# Altium project AI_Thinker.PrjPCB
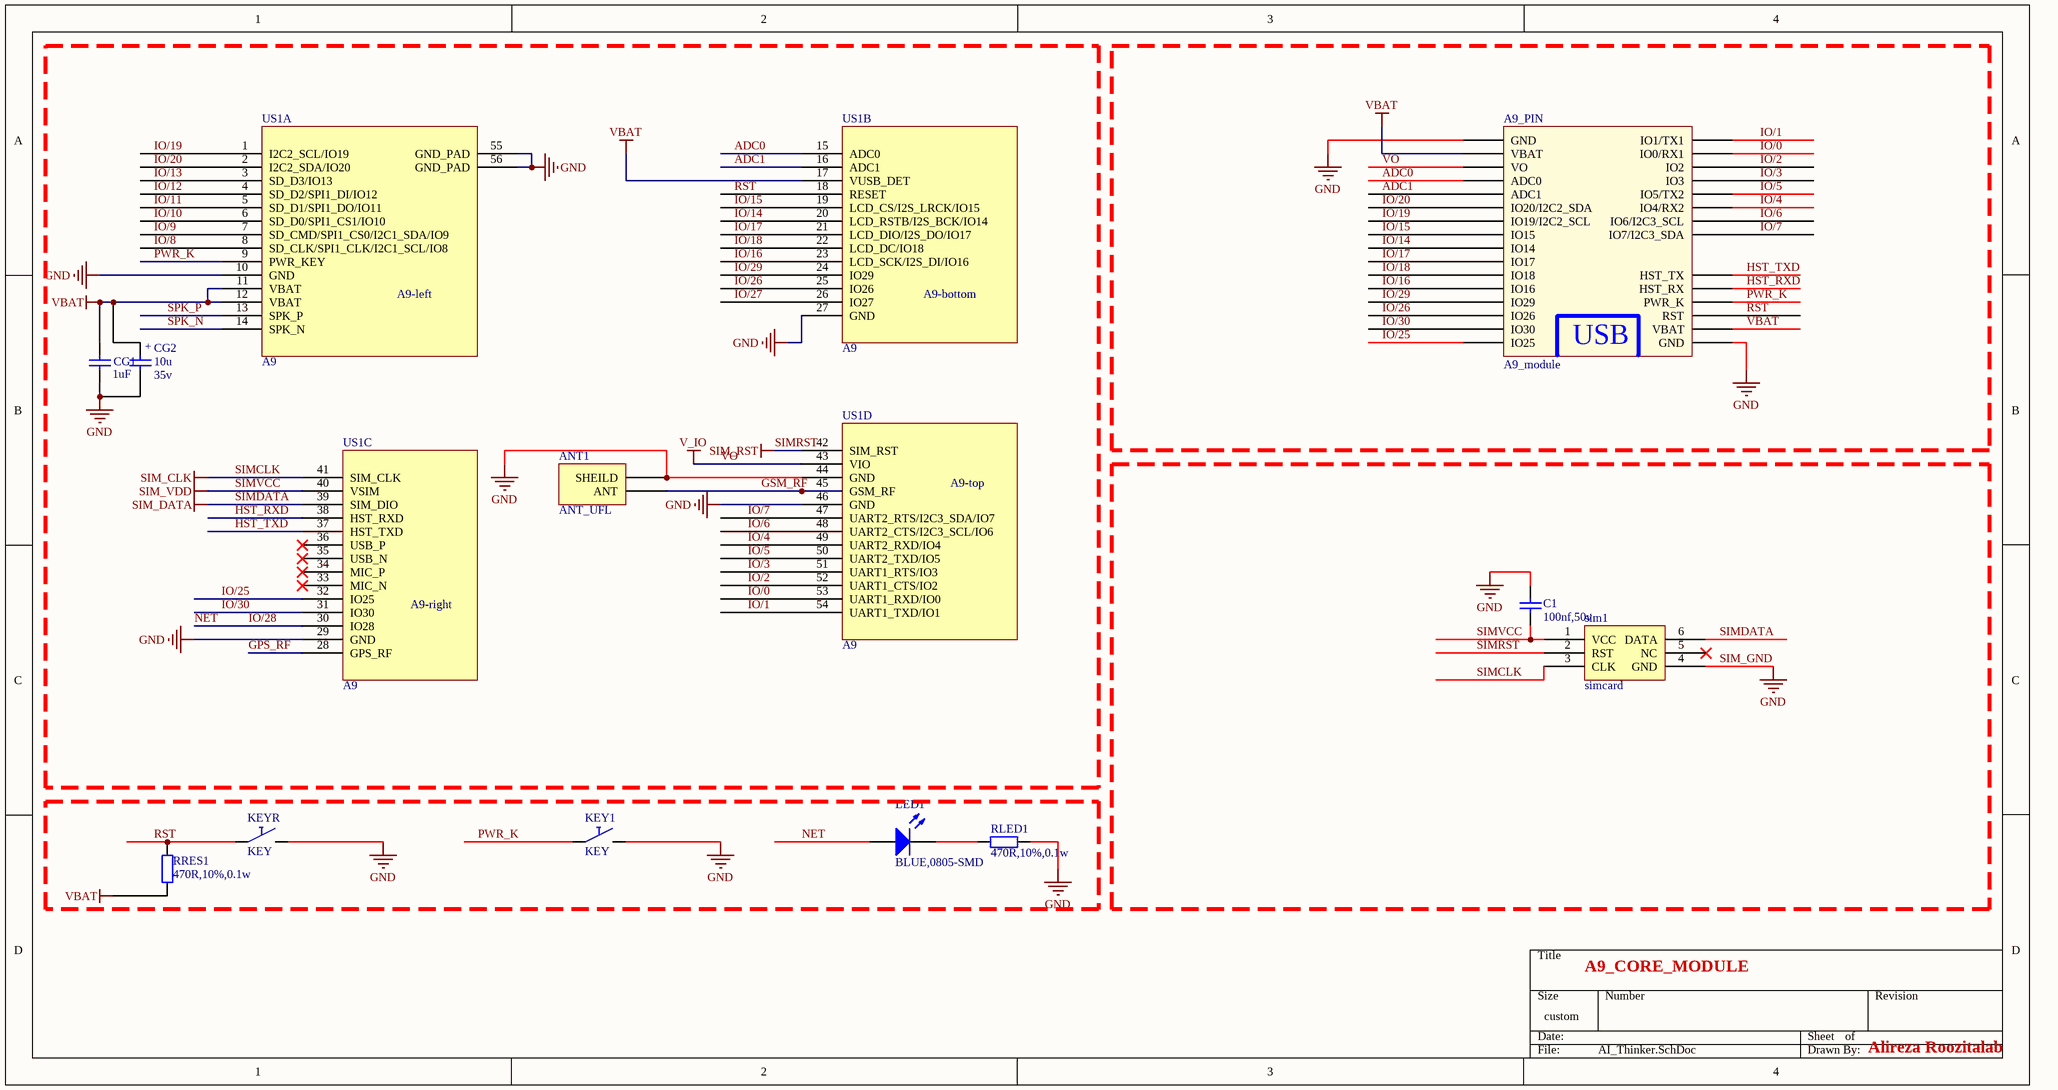
[diagram p0: AI_Thinker.SchDoc]
1 sheet, 12 parts. Net scope: global (net labels, ports and power ports of the same name join across sheets).
Board file: AI_Thinker.PcbDoc

## Sheet AI_Thinker.SchDoc
size 381 x 203 mm; Organization: Altium Limited; Address1: L3, 12a Rodborough Rd; Address2: Frenchs Forest; Address3: NSW; Address4: Australia 2086

### Parts
A9_PIN  A9_module  [A9_MODULE]
ANT1  ANT_UFL  [UFL_CON]
C1  100nf,50v  [0805.]
CG1  1uF  [CAP_SMD [1206]]
CG2  Volte: 35v  [MY_SMC_D]  (hidden comment: 10u)
KEY1  KEY  [SMD_KEY]
KEYR  KEY  [SMD_KEY]
LED1  BLUE,0805-SMD  [0805.]
RLED1  470R,10%,0.1w  [0805.]
RRES1  470R,10%,0.1w  [0805.]
sim1  simcard  [SIMCARD_M]
US1  A9  [A9]  (parts A,B,C,D of 4)

### Nets
SIM_GND: A9_PIN.1(GND) A9_PIN.17(GND) ANT1.1(SHEILD) C1.2 CG1.1 CG2.- KEY1.2 KEYR.2 RLED1.2 sim1.4(GND) US1.10(GND) US1.27(GND) US1.29(GND) US1.44(GND) US1.46(GND) US1.55(GND_PAD) US1.56(GND_PAD)  [also labelled GND]
SIMCLK: sim1.3(CLK) US1.41(SIM_CLK)  [also labelled SIM_CLK]
SIMDATA: sim1.6(DATA) US1.39(SIM_DIO)  [also labelled SIM_DATA]
SIMRST: sim1.2(RST) US1.42(SIM_RST)  [also labelled SIM_RST]
SIMVCC: C1.1 sim1.1(VCC) US1.40(VSIM)  [also labelled SIM_VDD]
VBAT: A9_PIN.2(VBAT) A9_PIN.18(VBAT) CG1.2 CG2.+ RRES1.1 US1.11(VBAT) US1.12(VBAT) US1.17(VUSB_DET)
VO: A9_PIN.3(VO) US1.43(VIO)  [also labelled V_IO]
ADC0: A9_PIN.4(ADC0) US1.15(ADC0)
ADC1: A9_PIN.5(ADC1) US1.16(ADC1)
GPS_RF: US1.28(GPS_RF)
GSM_RF: ANT1.2(ANT) US1.45(GSM_RF)
HST_RXD: A9_PIN.21(HST_RX) US1.38(HST_RXD)
HST_TXD: A9_PIN.22(HST_TX) US1.37(HST_TXD)
IO/0: A9_PIN.29(IO0/RX1) US1.53(UART1_RXD/IO0)
IO/1: A9_PIN.30(IO1/TX1) US1.54(UART1_TXD/IO1)
IO/2: A9_PIN.28(IO2) US1.52(UART1_CTS/IO2)
IO/3: A9_PIN.27(IO3) US1.51(UART1_RTS/IO3)
IO/4: A9_PIN.25(IO4/RX2) US1.49(UART2_RXD/IO4)
IO/5: A9_PIN.26(IO5/TX2) US1.50(UART2_TXD/IO5)
IO/6: A9_PIN.24(IO6/I2C3_SCL) US1.48(UART2_CTS/I2C3_SCL/IO6)
IO/7: A9_PIN.23(IO7/I2C3_SDA) US1.47(UART2_RTS/I2C3_SDA/IO7)
IO/8: US1.8(SD_CLK/SPI1_CLK/I2C1_SCL/IO8)
IO/9: US1.7(SD_CMD/SPI1_CS0/I2C1_SDA/IO9)
IO/10: US1.6(SD_D0/SPI1_CS1/IO10)
IO/11: US1.5(SD_D1/SPI1_DO/IO11)
IO/12: US1.4(SD_D2/SPI1_DI/IO12)
IO/13: US1.3(SD_D3/IO13)
IO/14: A9_PIN.9(IO14) US1.20(LCD_RSTB/I2S_BCK/IO14)
IO/15: A9_PIN.8(IO15) US1.19(LCD_CS/I2S_LRCK/IO15)
IO/16: A9_PIN.12(IO16) US1.23(LCD_SCK/I2S_DI/IO16)
IO/17: A9_PIN.10(IO17) US1.21(LCD_DIO/I2S_DO/IO17)
IO/18: A9_PIN.11(IO18) US1.22(LCD_DC/IO18)
IO/19: A9_PIN.7(IO19/I2C2_SCL) US1.1(I2C2_SCL/IO19)
IO/20: A9_PIN.6(IO20/I2C2_SDA) US1.2(I2C2_SDA/IO20)
IO/25: A9_PIN.16(IO25) US1.32(IO25)
IO/26: A9_PIN.14(IO26) US1.25(IO26)
IO/27: US1.26(IO27)
IO/28: LED1.2(A) US1.30(IO28)  [also labelled NET]
IO/29: A9_PIN.13(IO29) US1.24(IO29)
IO/30: A9_PIN.15(IO30) US1.31(IO30)
PWR_K: A9_PIN.20(PWR_K) KEY1.1 US1.9(PWR_KEY)
RST: A9_PIN.19(RST) KEYR.1 RRES1.2 US1.18(RESET)
SPK_N: US1.14(SPK_N)
SPK_P: US1.13(SPK_P)
NetLED1_1: LED1.1(K) RLED1.1

Not connected (* = marked no-connect by the designer): sim1 5(NC)*; US1 33(MIC_N)* 34(MIC_P)* 35(USB_N)* 36(USB_P)*

### Notes on the sheet
- A9_CORE_MODULE
- Alireza Roozitalab
- Title
- Size:
- Date:
- A4
- Number:
- Time:
- Revision:
- Sheet
- of
- File:
- (in symbol A9, part A) A9-left
- (in symbol A9, part B) A9-bottom
- (in symbol A9, part C) A9-right
- (in symbol A9, part D) A9-top
- (in symbol A9_module) USB

### Library data of the parts
C1 = Cap: Capacitor; Published: 8-Jun-2000; LatestRevisionDate: 17-Jul-2002; LatestRevisionNote: Re-released for DXP Platform.; PackageReference: RAD-0.3; Publisher: Altium Limited
CG1 = Cap_smd [1206]: Capacitor; Revision: July-2002: Re-released for DXP Platform.; Device Type: CAPACITOR; Package Type: smd; part number: Capacitor; Package: [1206]
CG2 = Cap Pol: Polar capacitor; ASiD Part Number: C-AS; Value: 10u
LED1 = LED0: Typical INFRARED GaAs LED; Published: 8-Jun-2000; LatestRevisionDate: 08-Jul-2005; LatestRevisionNote: Mech Layer 1 removed.; PackageReference: LED-0; Publisher: Altium Limited
RLED1 RRES1 = Res2: Resistor; Published: 8-Jun-2000; LatestRevisionDate: 17-Jul-2002; LatestRevisionNote: Re-released for DXP Platform.; PackageReference: AXIAL-0.4; Publisher: Altium Limited